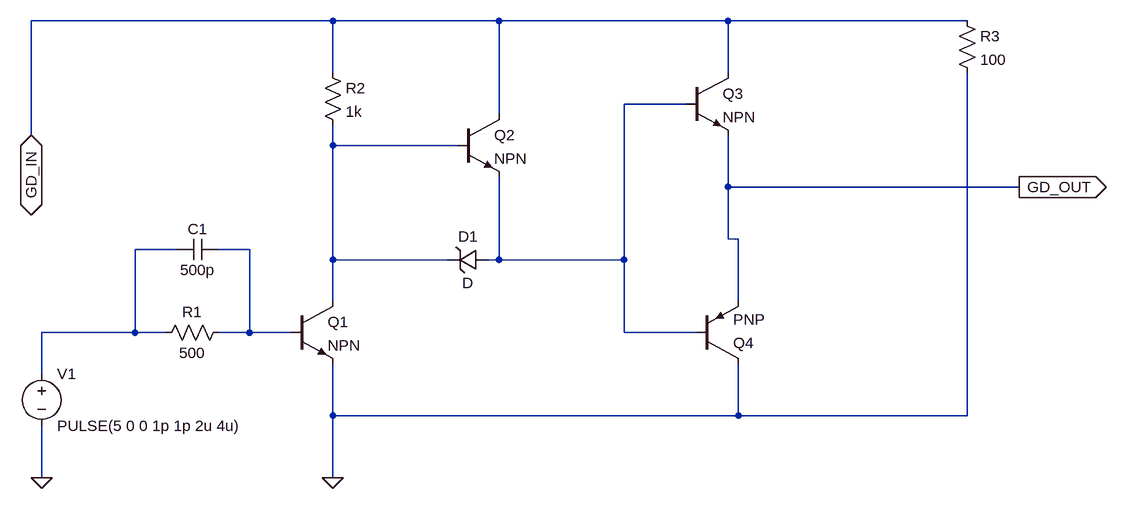
[diagram p0: schematic GateDriver.asc]
GateDriver.asc, the LTspice schematic file:
Version 4
SHEET 1 1304 720
WIRE 112 0 -352 0
WIRE 368 0 112 0
WIRE 720 0 368 0
WIRE 1088 0 720 0
WIRE 112 80 112 0
WIRE 720 80 720 0
WIRE 656 128 560 128
WIRE 368 144 368 0
WIRE -352 176 -352 0
WIRE 112 192 112 160
WIRE 304 192 112 192
WIRE 720 256 720 176
WIRE 1168 256 720 256
WIRE 720 336 720 256
WIRE 736 336 720 336
WIRE -128 352 -192 352
WIRE -16 352 -64 352
WIRE 112 368 112 192
WIRE 288 368 112 368
WIRE 368 368 368 240
WIRE 368 368 352 368
WIRE 560 368 560 128
WIRE 560 368 368 368
WIRE 112 432 112 368
WIRE 736 432 736 336
WIRE -192 480 -192 352
WIRE -192 480 -336 480
WIRE -144 480 -192 480
WIRE -16 480 -16 352
WIRE -16 480 -64 480
WIRE 48 480 -16 480
WIRE 560 480 560 368
WIRE 672 480 560 480
WIRE -336 544 -336 480
WIRE 112 608 112 528
WIRE 736 608 736 528
WIRE 736 608 112 608
WIRE 1088 608 1088 80
WIRE 1088 608 736 608
WIRE -336 704 -336 624
WIRE 112 704 112 608
FLAG -336 704 0
FLAG 112 704 0
FLAG -352 176 GD_IN
IOPIN -352 176 BiDir
FLAG 1168 256 GD_OUT
IOPIN 1168 256 Out
SYMBOL voltage -336 528 R0
SYMATTR InstName V1
SYMATTR Value PULSE(5 0 0 1p 1p 2u 4u)
SYMBOL Res -48 464 R90
WINDOW 0 0 56 VBottom 2
WINDOW 3 32 56 VTop 2
SYMATTR InstName R1
SYMATTR Value 500
SYMBOL Cap -64 336 R90
WINDOW 0 0 32 VBottom 2
WINDOW 3 32 32 VTop 2
SYMATTR InstName C1
SYMATTR Value 500p
SYMBOL Res 96 64 R0
SYMATTR InstName R2
SYMATTR Value 1k
SYMBOL npn 48 432 R0
SYMATTR InstName Q1
SYMBOL zener 352 352 R90
WINDOW 0 -4 32 VBottom 2
WINDOW 3 36 32 VTop 2
SYMATTR InstName D1
SYMBOL npn 304 144 R0
SYMATTR InstName Q2
SYMBOL npn 656 80 R0
SYMATTR InstName Q3
SYMBOL pnp 672 528 M180
SYMATTR InstName Q4
SYMBOL Res 1072 -16 R0
SYMATTR InstName R3
SYMATTR Value 100

The netlist it stands for:
* GateDriver.asc
V1 N003 0 PULSE(5 0 0 1p 1p 2u 4u)
R1 N004 N003 500
C1 N004 N003 500p
R2 GD_IN N002 1k
Q1 N002 N004 0 0 NPN
D1 N001 N002 D
Q2 GD_IN N002 N001 0 NPN
Q3 GD_IN N001 GD_OUT 0 NPN
Q4 0 N001 GD_OUT 0 PNP
R3 GD_IN 0 100
.model D D
.lib standard.dio
.model NPN NPN
.model PNP PNP
.lib standard.bjt
.backanno
.end